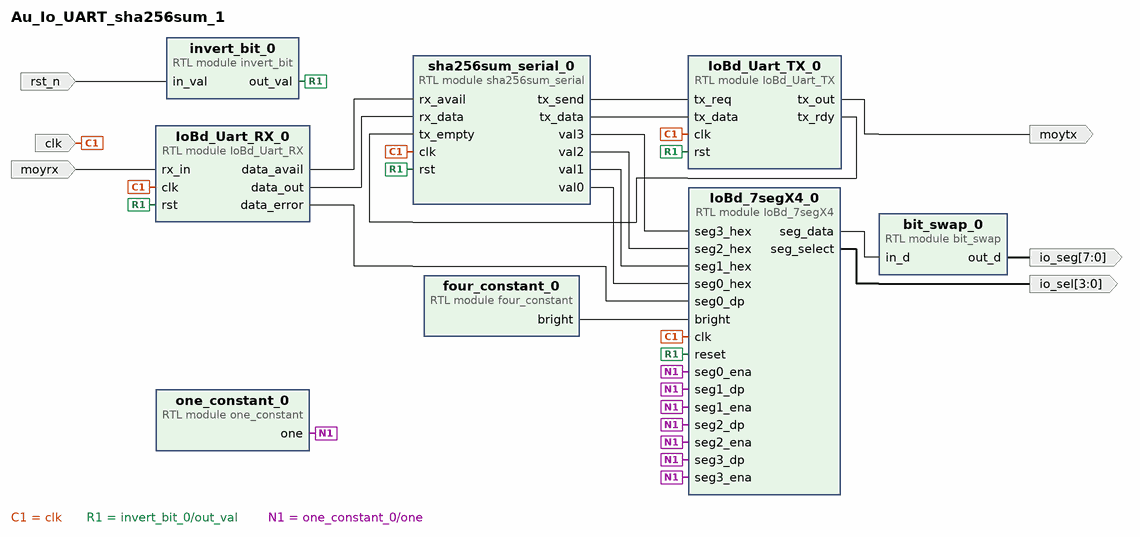
[diagram p0: block diagram of the top level]
# Vivado block design Au_Io_UART_sha256sum_1, xc7a35tftg256-1, Vivado 2020.1.1
create_bd_design Au_Io_UART_sha256sum_1

create_bd_port -dir I -type clk clk
set_property -dict {CONFIG.FREQ_HZ 100000000} [get_bd_ports clk]
create_bd_port -dir I -type data moyrx
create_bd_port -dir O -type data moytx
create_bd_port -dir O -from 7 -to 0 io_seg
create_bd_port -dir O -from 3 -to 0 io_sel
create_bd_port -dir I -type rst rst_n

create_bd_cell -type module -reference IoBd_Uart_RX IoBd_Uart_RX_0
create_bd_cell -type module -reference IoBd_Uart_TX IoBd_Uart_TX_0
create_bd_cell -type module -reference sha256sum_serial sha256sum_serial_0
create_bd_cell -type module -reference IoBd_7segX4 IoBd_7segX4_0
create_bd_cell -type module -reference bit_swap bit_swap_0
create_bd_cell -type module -reference one_constant one_constant_0
create_bd_cell -type module -reference invert_bit invert_bit_0
create_bd_cell -type module -reference four_constant four_constant_0

# ---- connections ----

connect_bd_net [get_bd_pins sha256sum_serial_0/tx_send] [get_bd_pins IoBd_Uart_TX_0/tx_req]
connect_bd_net [get_bd_pins IoBd_Uart_RX_0/data_avail] [get_bd_pins sha256sum_serial_0/rx_avail]
connect_bd_net [get_bd_pins IoBd_Uart_RX_0/data_out] [get_bd_pins sha256sum_serial_0/rx_data]
connect_bd_net [get_bd_pins IoBd_Uart_TX_0/tx_rdy] [get_bd_pins sha256sum_serial_0/tx_empty]
connect_bd_net [get_bd_pins sha256sum_serial_0/tx_data] [get_bd_pins IoBd_Uart_TX_0/tx_data]
connect_bd_net [get_bd_pins sha256sum_serial_0/val3] [get_bd_pins IoBd_7segX4_0/seg3_hex]
connect_bd_net [get_bd_pins sha256sum_serial_0/val2] [get_bd_pins IoBd_7segX4_0/seg2_hex]
connect_bd_net [get_bd_pins sha256sum_serial_0/val1] [get_bd_pins IoBd_7segX4_0/seg1_hex]
connect_bd_net [get_bd_pins sha256sum_serial_0/val0] [get_bd_pins IoBd_7segX4_0/seg0_hex]
connect_bd_net [get_bd_ports clk] \
  [get_bd_pins IoBd_Uart_RX_0/clk] [get_bd_pins IoBd_Uart_TX_0/clk] [get_bd_pins sha256sum_serial_0/clk] \
  [get_bd_pins IoBd_7segX4_0/clk]
connect_bd_net -net rst_n_1 [get_bd_pins invert_bit_0/out_val] \
  [get_bd_pins IoBd_Uart_RX_0/rst] [get_bd_pins IoBd_Uart_TX_0/rst] [get_bd_pins sha256sum_serial_0/rst] \
  [get_bd_pins IoBd_7segX4_0/reset]
connect_bd_net [get_bd_pins IoBd_Uart_TX_0/tx_out] [get_bd_ports moytx]
connect_bd_net [get_bd_ports moyrx] [get_bd_pins IoBd_Uart_RX_0/rx_in]
connect_bd_net [get_bd_pins IoBd_7segX4_0/seg_select] [get_bd_ports io_sel]
connect_bd_net -net bit_swap_0_out [get_bd_pins bit_swap_0/out_d] [get_bd_ports io_seg]
connect_bd_net [get_bd_pins IoBd_7segX4_0/seg_data] [get_bd_pins bit_swap_0/in_d]
connect_bd_net [get_bd_pins IoBd_Uart_RX_0/data_error] [get_bd_pins IoBd_7segX4_0/seg0_dp]
connect_bd_net [get_bd_pins one_constant_0/one] \
  [get_bd_pins IoBd_7segX4_0/seg3_dp] [get_bd_pins IoBd_7segX4_0/seg3_ena] [get_bd_pins IoBd_7segX4_0/seg2_dp] \
  [get_bd_pins IoBd_7segX4_0/seg2_ena] [get_bd_pins IoBd_7segX4_0/seg1_dp] [get_bd_pins IoBd_7segX4_0/seg1_ena] \
  [get_bd_pins IoBd_7segX4_0/seg0_ena]
connect_bd_net [get_bd_ports rst_n] [get_bd_pins invert_bit_0/in_val]
connect_bd_net [get_bd_pins four_constant_0/bright] [get_bd_pins IoBd_7segX4_0/bright]

validate_bd_design
save_bd_design
